# Altium schematic sheet STlinkv21.SchDoc
size A4
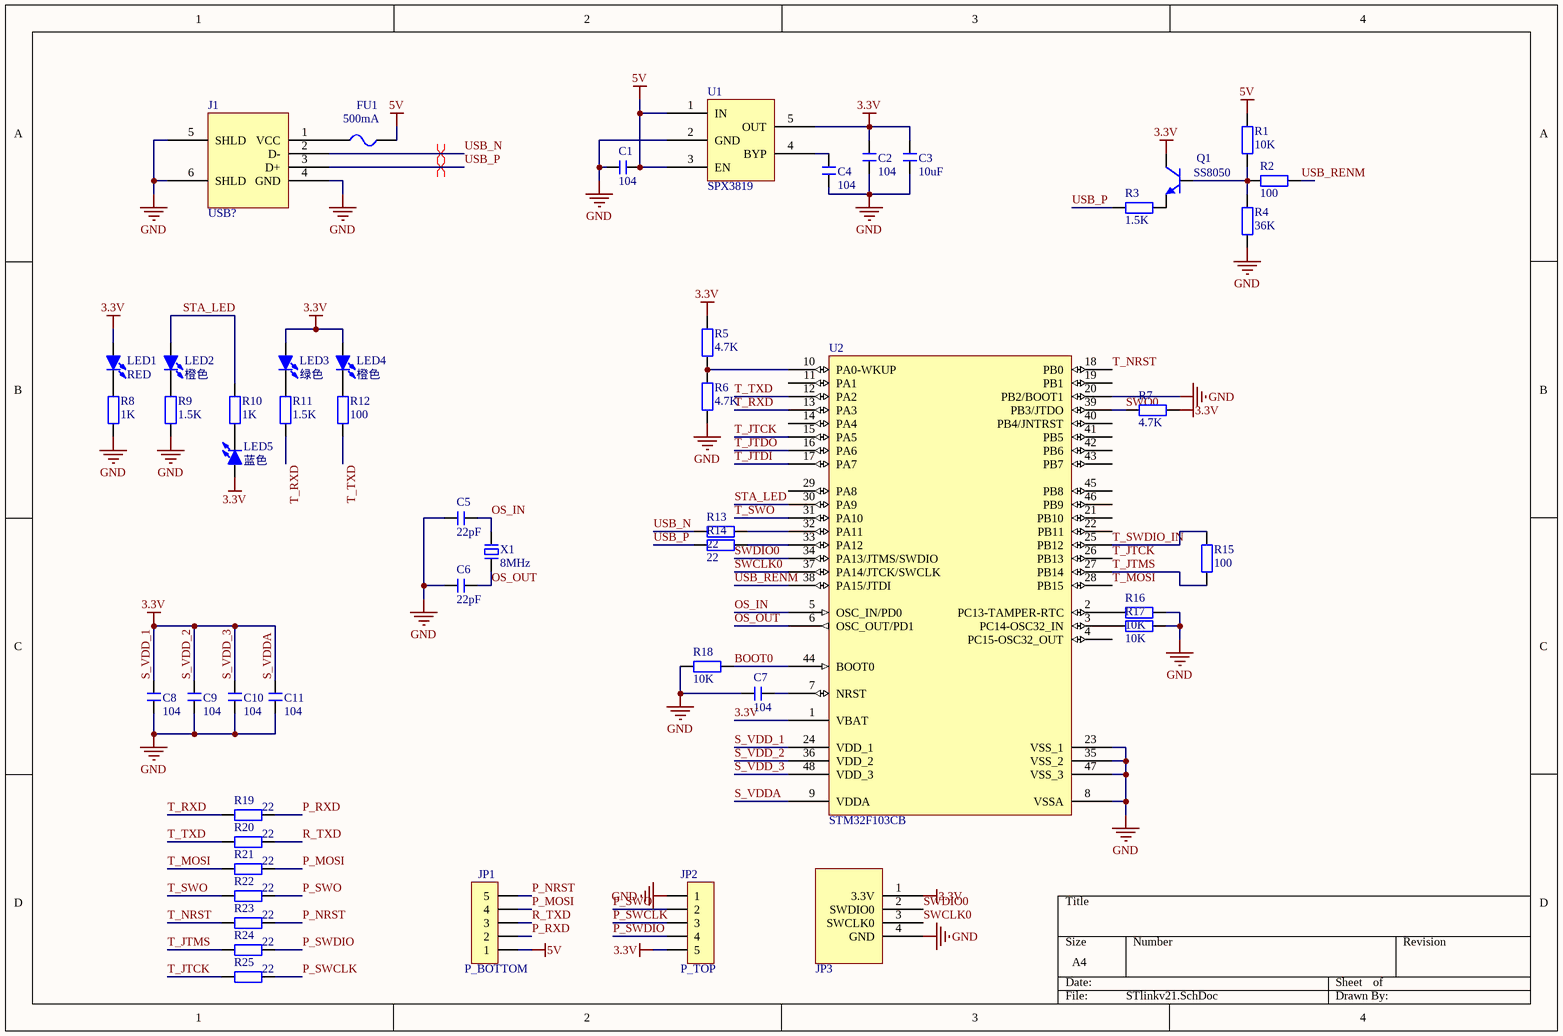
[diagram p0: STlinkv21.SchDoc]

## Parts
*  JP3  [JP4]
C1  104  [C 0603_L]
C2  104  [C 0603_L]
C3  10uF  [C 0603_L]
C4  104  [C 0603_L]
C5  22pF  [C 0603_L]
C6  22pF  [C 0603_L]
C7  104  [C 0603_L]
C8  104  [C 0603_L]
C9  104  [C 0603_L]
C10  104  [C 0603_L]
C11  104  [C 0603_L]
FU1  500mA  [FU 0805]
J1  USB?  [USB-A]
JP1  P_BOTTOM  [JP5Bottom]
JP2  P_TOP  [JP5TOP]
LED1  RED  [LED 0603B]
LED2  橙色  [LED 0603B]
LED3  绿色  [LED 0603B]
LED4  橙色  [LED 0603B]
LED5  蓝色  [LED 0603B]
Q1  SS8050  [SOT23-3N]
R1  10K  [R 0603_L]
R2  100  [R 0603_L]
R3  1.5K  [R 0603_L]
R4  36K  [R 0603_L]
R5  4.7K  [R 0603_L]
R6  4.7K  [R 0603_L]
R7  4.7K  [R 0603_L]
R8  1K  [R 0603_L]
R9  1.5K  [R 0603_L]
R10  1K  [R 0603_L]
R11  1.5K  [R 0603_L]
R12  100  [R 0603_L]
R13  22  [R 0603_L]
R14  22  [R 0603_L]
R15  100  [R 0603_L]
R16  10K  [R 0603_L]
R17  10K  [R 0603_L]
R18  10K  [R 0603_L]
R19  22  [R 0603_L]
R20  22  [R 0603_L]
R21  22  [R 0603_L]
R22  22  [R 0603_L]
R23  22  [R 0603_L]
R24  22  [R 0603_L]
R25  22  [R 0603_L]
U1  SPX3819  [SOT-23-5]
U2  STM32F103CB  [LQFP48 7X7_L]
X1  8MHz  [OSC 5032-2P]

## Nets
3.3V: *.1(3.3V) C2.2 C3.2 C8.2 C9.2 C10.2 C11.2 JP2.5 LED1.1(A) LED3.1(A) LED4.1(A) LED5.1(A) Q1.3(C) R5.2 R7.2 U1.5(OUT) U2.1(VBAT) U2.9(VDDA) U2.24(VDD_1) U2.36(VDD_2) U2.48(VDD_3)  [also labelled S_VDD_1, S_VDD_2, S_VDD_3, S_VDDA]
5V: C1.2 FU1.2 JP1.1 R1.2 U1.1(IN) U1.3(EN)
GND: *.4(GND) C1.1 C2.1 C3.1 C4.1 C5.1 C6.1 C7.1 C8.1 C9.1 C10.1 C11.1 J1.4(GND) J1.5(SHLD) J1.6(SHLD) JP2.1 R4.1 R6.1 R8.1 R9.1 R16.1 R17.1 R18.2 U1.2(GND) U2.8(VSSA) U2.20(PB2/BOOT1) U2.23(VSS_1) U2.35(VSS_2) U2.47(VSS_3)
BOOT0: R18.1 U2.44(BOOT0)
OS_IN: C5.2 U2.5(OSC_IN/PD0) X1.2
OS_OUT: C6.2 U2.6(OSC_OUT/PD1) X1.1
P_MOSI: JP1.4 R21.1
P_NRST: JP1.5 R23.1
P_RXD: JP1.2 R19.1
P_SWCLK: JP2.3 R25.1
P_SWDIO: JP2.4 R24.1
P_SWO: JP2.2 R22.1
R_TXD: JP1.3 R20.1
STA_LED: LED2.1(A) R10.2 U2.30(PA9)
SWCLK0: *.3(SWCLK0) U2.37(PA14/JTCK/SWCLK)
SWDIO0: *.2(SWDIO0) U2.34(PA13/JTMS/SWDIO)
SWO0: R7.1 U2.39(PB3/JTDO)
T_JTCK: R25.2 U2.15(PA5) U2.26(PB13)
T_JTDI: U2.17(PA7)
T_JTDO: U2.16(PA6)
T_JTMS: R15.2 R24.2 U2.27(PB14)
T_MOSI: R21.2 U2.28(PB15)
T_NRST: R23.2 U2.18(PB0)
T_RXD: R11.1 R19.2 U2.13(PA3)
T_SWDIO_IN: R15.1 U2.25(PB12)
T_SWO: R22.2 U2.31(PA10)
T_TXD: R12.1 R20.2 U2.12(PA2)
USB_N: J1.2(D-) R13.2
USB_P: J1.3(D+) R3.1 R14.2
USB_RENM: R2.2 U2.38(PA15/JTDI)
NetC4_2: C4.2 U1.4(BYP)
NetC7_2: C7.2 U2.7(NRST)
NetFU1_1: FU1.1 J1.1(VCC)
NetLED1_2: LED1.2(K) R8.2
NetLED2_2: LED2.2(K) R9.2
NetLED3_2: LED3.2(K) R11.2
NetLED4_2: LED4.2(K) R12.2
NetLED5_2: LED5.2(K) R10.1
NetQ1_1: Q1.1(B) R1.1 R2.1 R4.2
NetQ1_2: Q1.2(E) R3.2
NetR5_1: R5.1 R6.2 U2.10(PA0-WKUP)
NetR13_1: R13.1 U2.32(PA11)
NetR14_1: R14.1 U2.33(PA12)
NetR16_2: R16.2 U2.2(PC13-TAMPER-RTC)
NetR17_2: R17.2 U2.3(PC14-OSC32_IN)

Not connected (* = marked no-connect by the designer): U2 4(PC15-OSC32_OUT) 11(PA1) 14(PA4) 19(PB1) 21(PB10) 22(PB11) 29(PA8) 40(PB4/JNTRST) 41(PB5) 42(PB6) 43(PB7) 45(PB8) 46(PB9)

## Layout directives
differential pair: USB_N, USB_P

## Library data of the parts
* = JP?
C1-C11 = C: 无极性贴片电容; 版权归属: 源创客; BOM名称: 无极性贴片电容; 学习资源: www.ooocke.com
FU1 = FU: 贴片保险丝; 版权归属: 源创客; BOM名称: 贴片保险丝; 学习资源: www.ooocke.com
JP1 JP2 = Header 5: 5P接插件; 版权归属: 源创客; BOM名称: 5P接插件; 学习资源: www.ooocke.com
LED1-LED5 = LED-SMD: 贴片LED; 版权归属: 源创客; BOM名称: 贴片LED; 学习资源: www.ooocke.com
Q1 = 8050-SMD: 高频放大-NPN型; 版权归属: 源创客; 属性: 40V 1.5A 1W 100MHZ; BOM名称: 高频放大-NPN型; 学习资源: www.ooocke.com
R1-R25 = R: 贴片电阻; 版权归属: 源创客; BOM名称: 贴片电阻; 学习资源: www.ooocke.com
U2 = STM32F103C8: Flaah:64/RAM:20/IO:36; BOM名称: 32位STM单片机; 版权归属: 源创客; 学习资源: www.ooocke.com
X1 = XTAL-2P: 2脚无源脚晶振; 版权归属: 源创客; BOM名称: 2脚无源脚晶振; 学习资源: www.ooocke.com